# EAGLE schematic SignalEditor (EAGLE 9.6.2)
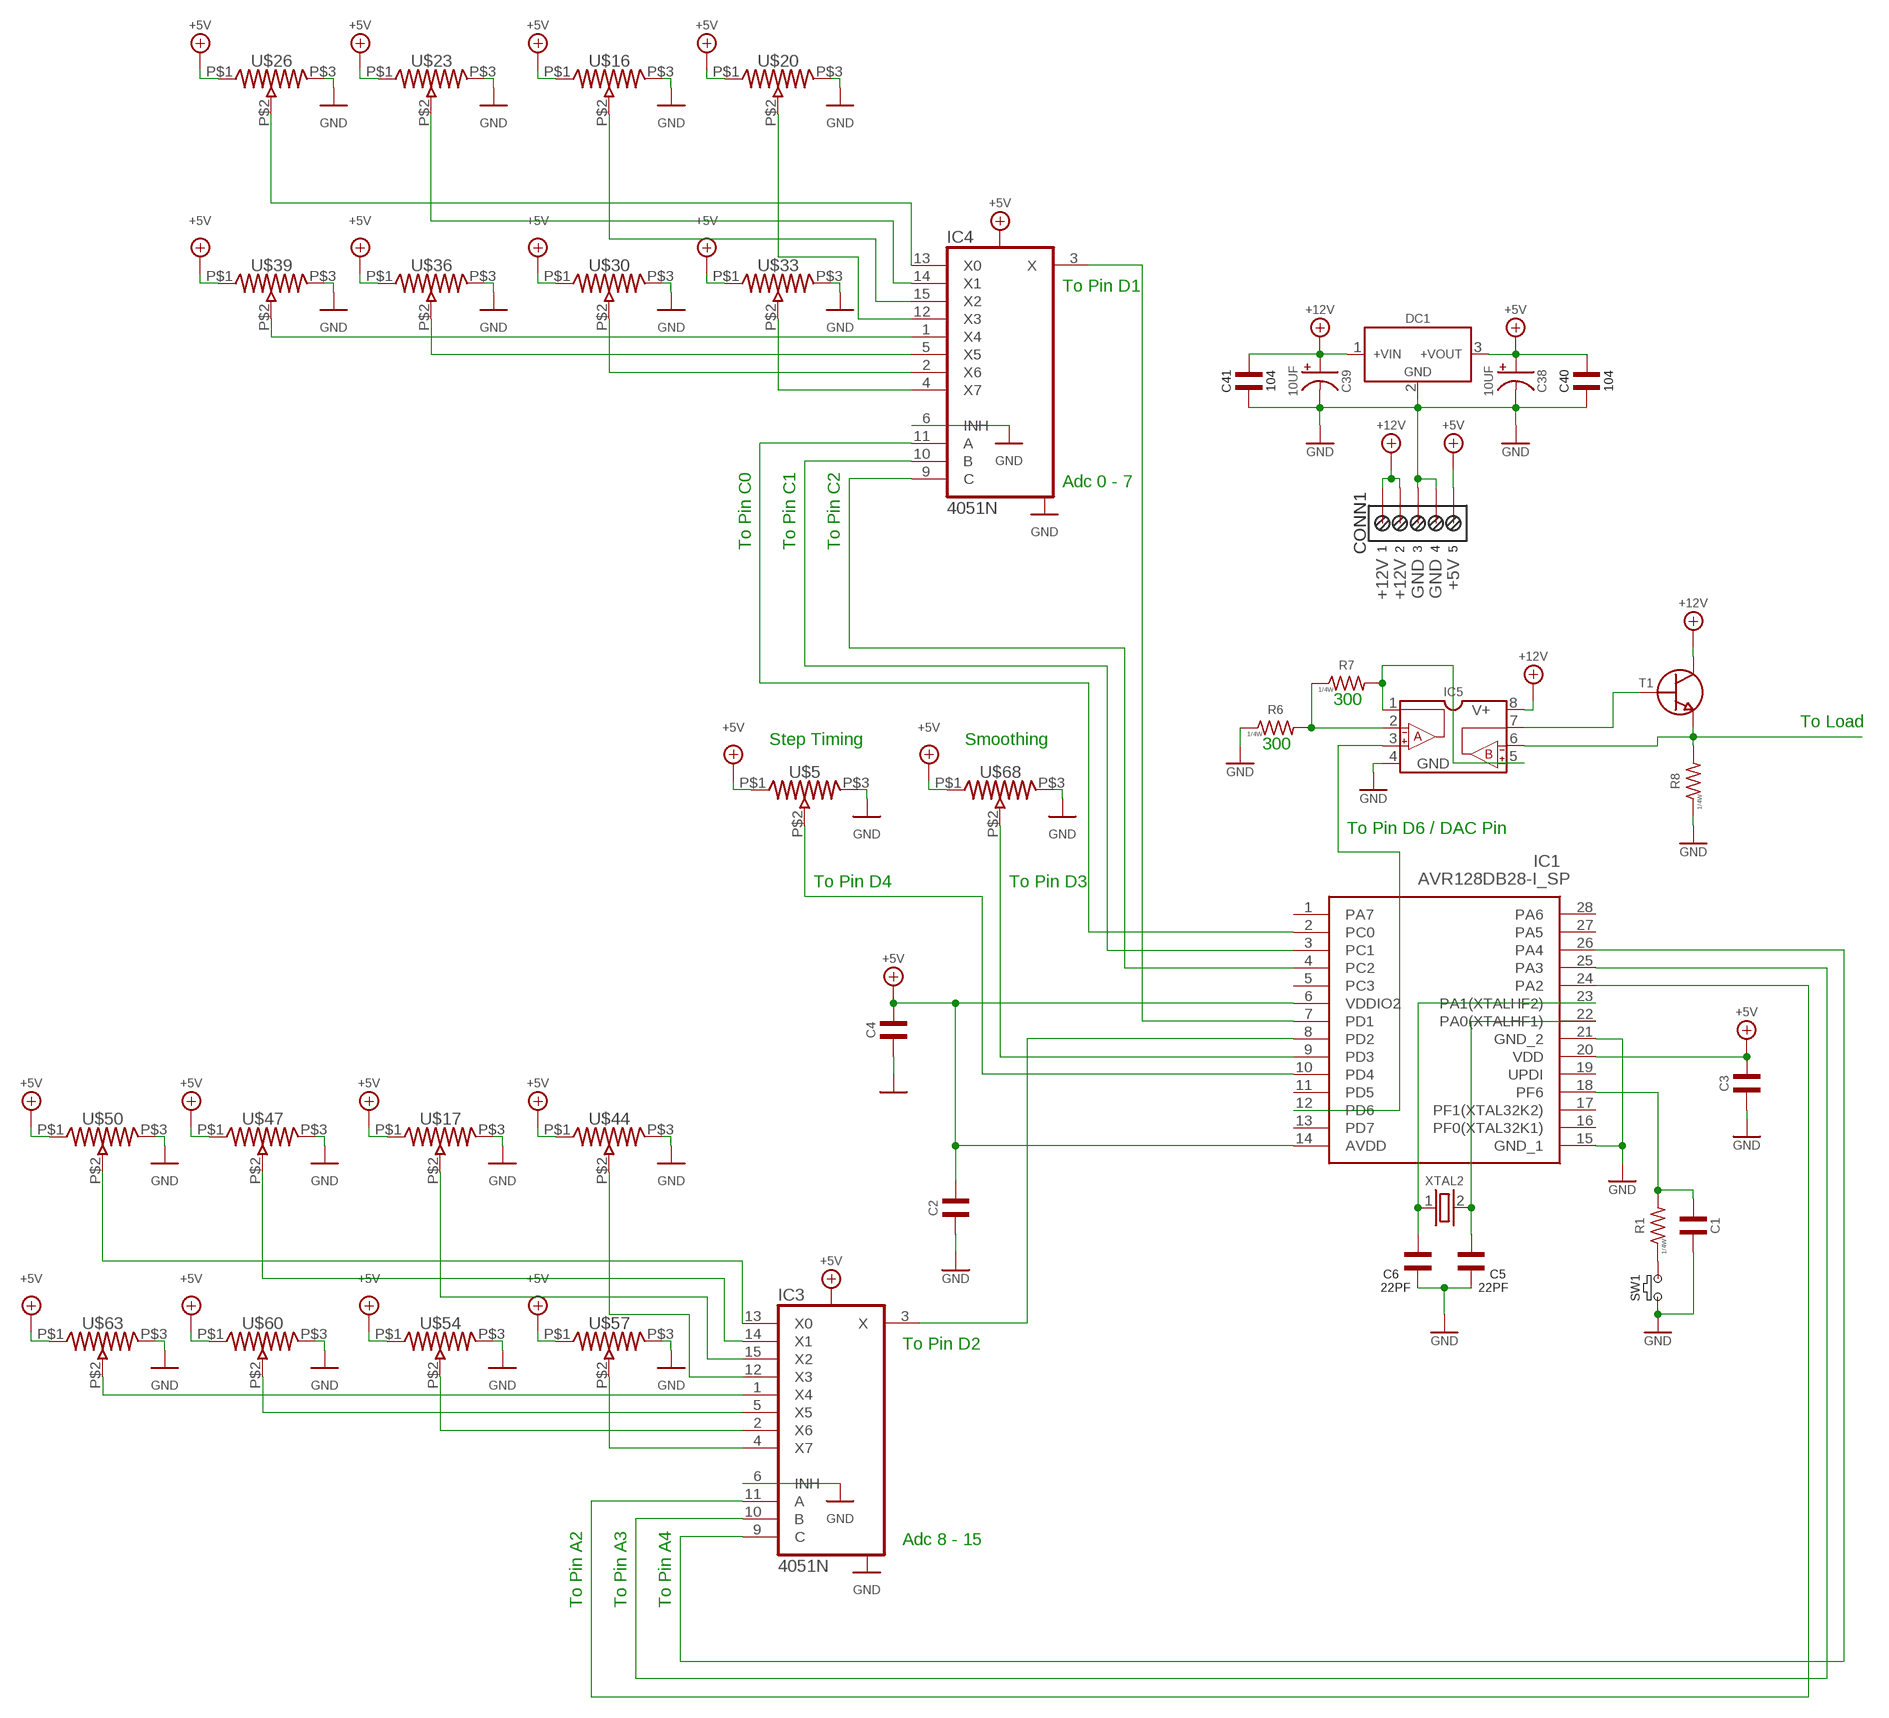
[diagram p0: schematic, sheet 1]

## Parts
C1  040-005-032  [CAPACITOR-CERAMIC-AXIAL]
C2  040-005-032  [CAPACITOR-CERAMIC-AXIAL]
C3  040-005-032  [CAPACITOR-CERAMIC-AXIAL]
C4  040-005-032  [CAPACITOR-CERAMIC-AXIAL]
C5  22PF  040-005-038  [CAPACITOR-CERAMIC-AXIAL]
C6  22PF  040-005-038  [CAPACITOR-CERAMIC-AXIAL]
C38  10UF  040-005-005  [CAPACITOR-RADIAL]
C39  10UF  040-005-005  [CAPACITOR-RADIAL]
C40  104  040-005-032  [CAPACITOR-CERAMIC-AXIAL]
C41  104  040-005-032  [CAPACITOR-CERAMIC-AXIAL]
CONN1  030-019-017  [030-007-024]
DC1  5V-DC-DC-CONVERTER_RECOM  [5V-DC-DC-CONVERTER_RECOM]
IC1  AVR128DB28-I_SP  [DIP794W56P254L3486H508Q28N]
IC3  4051N  [DIL16]
IC4  4051N  [DIL16]
IC5  040-002-002  [040-010-001]
R1  040-001-024  [RESISTOR-1/4W]
R6  040-001-017  [RESISTOR-1/4W]
R7  040-001-017  [RESISTOR-1/4W]
R8  040-001-015  [RESISTOR-1/4W]
SW1  030-011-050  [SWITCH-PB-SMD]
T1  040-004-002  [TRANSISTOR-TO92]
U$5  5K_POT_THROUGH_HOLE  [POT-TRIM-SMALL]
U$16  5K_POT_THROUGH_HOLE  [POT-TRIM-SMALL]
U$17  5K_POT_THROUGH_HOLE  [POT-TRIM-SMALL]
U$20  5K_POT_THROUGH_HOLE  [POT-TRIM-SMALL]
U$23  5K_POT_THROUGH_HOLE  [POT-TRIM-SMALL]
U$26  5K_POT_THROUGH_HOLE  [POT-TRIM-SMALL]
U$30  5K_POT_THROUGH_HOLE  [POT-TRIM-SMALL]
U$33  5K_POT_THROUGH_HOLE  [POT-TRIM-SMALL]
U$36  5K_POT_THROUGH_HOLE  [POT-TRIM-SMALL]
U$39  5K_POT_THROUGH_HOLE  [POT-TRIM-SMALL]
U$44  5K_POT_THROUGH_HOLE  [POT-TRIM-SMALL]
U$47  5K_POT_THROUGH_HOLE  [POT-TRIM-SMALL]
U$50  5K_POT_THROUGH_HOLE  [POT-TRIM-SMALL]
U$54  5K_POT_THROUGH_HOLE  [POT-TRIM-SMALL]
U$57  5K_POT_THROUGH_HOLE  [POT-TRIM-SMALL]
U$60  5K_POT_THROUGH_HOLE  [POT-TRIM-SMALL]
U$63  5K_POT_THROUGH_HOLE  [POT-TRIM-SMALL]
U$68  5K_POT_THROUGH_HOLE  [POT-TRIM-SMALL]
XTAL2  12MHZ-CRYSTAL-SHORT  [CRYSTAL-SHORT]

## Nets
+5V: C2.2 C3.2 C4.2 C38.+ C40.2 CONN1.5 DC1.3(+VOUT) IC1.6(VDDIO2) IC1.14(AVDD) IC1.20(VDD) U$5.P$1 U$16.P$1 U$17.P$1 U$20.P$1 U$23.P$1 U$26.P$1 U$30.P$1 U$33.P$1 U$36.P$1 U$39.P$1 U$44.P$1 U$47.P$1 U$50.P$1 U$54.P$1 U$57.P$1 U$60.P$1 U$63.P$1 U$68.P$1
+12V: C39.+ C41.2 CONN1.1 CONN1.2 DC1.1(+VIN) IC5.8(V+) T1.C
GND: C1.1 C2.1 C3.1 C4.1 C5.1 C6.1 C38.- C39.- C40.1 C41.1 CONN1.3 CONN1.4 DC1.2(GND) IC1.15(GND_1) IC1.21(GND_2) IC3.6(INH) IC4.6(INH) IC5.4(GND) R6.P$1 R8.P$1 SW1.1 U$5.P$3 U$16.P$3 U$17.P$3 U$20.P$3 U$23.P$3 U$26.P$3 U$30.P$3 U$33.P$3 U$36.P$3 U$39.P$3 U$44.P$3 U$47.P$3 U$50.P$3 U$54.P$3 U$57.P$3 U$60.P$3 U$63.P$3 U$68.P$3
N$1: IC1.10(PD4) U$5.P$2
N$2: R1.P$1 SW1.2
N$3: C1.2 IC1.18(PF6) R1.P$2
N$4: IC1.8(PD2) IC3.3(X)
N$21: C6.2 IC1.23(PA1(XTALHF2)) XTAL2.1
N$22: C5.2 IC1.22(PA0(XTALHF1)) XTAL2.2
N$23: IC4.4(X7) U$33.P$2
N$24: IC4.2(X6) U$30.P$2
N$25: IC4.5(X5) U$36.P$2
N$26: IC4.1(X4) U$39.P$2
N$27: IC4.12(X3) U$20.P$2
N$28: IC4.15(X2) U$16.P$2
N$29: IC4.14(X1) U$23.P$2
N$30: IC4.13(X0) U$26.P$2
N$31: IC3.4(X7) U$57.P$2
N$32: IC3.2(X6) U$54.P$2
N$33: IC3.5(X5) U$60.P$2
N$34: IC3.1(X4) U$63.P$2
N$35: IC3.12(X3) U$44.P$2
N$36: IC3.15(X2) U$17.P$2
N$37: IC3.14(X1) U$47.P$2
N$38: IC3.13(X0) U$50.P$2
N$43: IC1.9(PD3) U$68.P$2
N$44: IC1.2(PC0) IC4.11(A)
N$46: IC1.3(PC1) IC4.10(B)
N$47: IC1.4(PC2) IC4.9(C)
N$48: IC1.24(PA2) IC3.11(A)
N$49: IC1.25(PA3) IC3.10(B)
N$50: IC1.26(PA4) IC3.9(C)
N$51: IC1.7(PD1) IC4.3(X)
N$52: IC5.6(-INB) R8.P$2 T1.E
N$53: IC5.7(OUTB) T1.B
N$54: IC5.2(-INA) R6.P$2 R7.P$1
N$55: IC5.1(OUTA) IC5.5(+INB) R7.P$2
N$56: IC1.12(PD6) IC5.3(+INA)
Unconnected: IC1.1(PA7) IC1.5(PC3) IC1.11(PD5) IC1.13(PD7) IC1.16(PF0(XTAL32K1)) IC1.17(PF1(XTAL32K2)) IC1.19(UPDI) IC1.27(PA5) IC1.28(PA6)

## Notes on the sheet
- To Pin D1
- Adc 0 - 7
- To Pin C0 | To Pin C1 | To Pin C2
- +12V | +12V | GND | GND | +5V
- 300
- To Load
- Step Timing | Smoothing | 300
- To Pin D6 / DAC Pin
- To Pin D4 | To Pin D3
- To Pin D2
- Adc 8 - 15
- To Pin A2 | To Pin A3 | To Pin A4

## Power pins joined to a net without a drawn wire
GND: IC3.8(GND) IC4.8(GND)
VCC: IC3.16(VCC) IC4.16(VCC)
VEE: IC3.7(VEE) IC4.7(VEE)

## Library data of the parts
C1-C4 C40 C41 = ATECH - CAPACITORS:040-005-032: .1UF CERAMIC AXIAL CAPACITOR
C5 C6 = ATECH - CAPACITORS:040-005-038: 22PF CERAMIC AXIAL CAP
C38 C39 = ATECH - CAPACITORS:040-005-005: 10 uf RADIAL
CONN1 = ATECH - PCB PARTS:030-019-017: 5 POLE WAGO TERM. BLOCK
DC1 = ATECH - PCB PARTS:5V-DC-DC-CONVERTER_RECOM
IC1 = SamacSys_Parts:AVR128DB28-I_SP: 8-bit Microcontrollers - MCU 128KB, SPDIP28, 85C, 24MHz, 12b ADC, Comp, Opamp, MVIO, ZCD, DAC, UART, SPI, TWI Source: Datasheet <https://ww1.microchip.com/downloads/en/DeviceDoc/AVR128DB28-32-48-64-DataSheet-DS40002247A.pdf>; DESCRIPTION: 8-bit Microcontrollers - MCU 128KB, SPDIP28, 85C, 24MHz, 12b ADC, Comp, Opamp, MVIO, ZCD, DAC, UART, SPI, TWI; HEIGHT: 5.08mm; MANUFACTURER_NAME: Microchip; MANUFACTURER_PART_NUMBER: AVR128DB28-I/SP; MOUSER_PART_NUMBER: 579-AVR128DB28-I/SP; MOUSER_PRICE-STOCK: https://www.mouser.co.uk/ProductDetail/Microchip-Technology/AVR128DB28-I-SP?qs=vmHwEFxEFR9SktvWL9jpqg%3D%3D
IC3 IC4 = 40xx:4051: 8-channel ANALOG MULTIPLEXER
IC5 = ATECH - IC:040-002-002: LM358N OP AMP
R1 = ATECH - RESISTORS:040-001-024: 4.7K OHMS, 1/4W - 5%T
R6 R7 = ATECH - RESISTORS:040-001-017: 300 OHMS, 1/4W - 5%T
R8 = ATECH - RESISTORS:040-001-015: 200K OHMS, 1/4W - 5%T
SW1 = ATECH - PCB PARTS:030-011-050: SPST TACTILE SWITCH, 12V SMD
T1 = ATECH - TRANSISTORS:040-004-002: NPN - 2N3904 (TO-92)
U$5 U$16 U$17 U$20 U$23 U$26 U$30 U$33 U$36 U$39 U$44 U$47 U$50 U$54 U$57 U$60 U$63 U$68 = ATECH - PCB PARTS:5K_POT_THROUGH_HOLE: 5K POT, 1 TURN THROUGH HOLE
XTAL2 = ATECH - PCB PARTS:12MHZ-CRYSTAL-SHORT